# Altium schematic sheet CW308T_CC2538_UFO.SchDoc: UFO Connections
size Letter; Organization: NewAE Technology Inc.; Address1: 1083 Queen St., Suite 196; Address2: Halifax; Address3: NS; Address4: Canada B3H 0B2; SheetApproved: NO
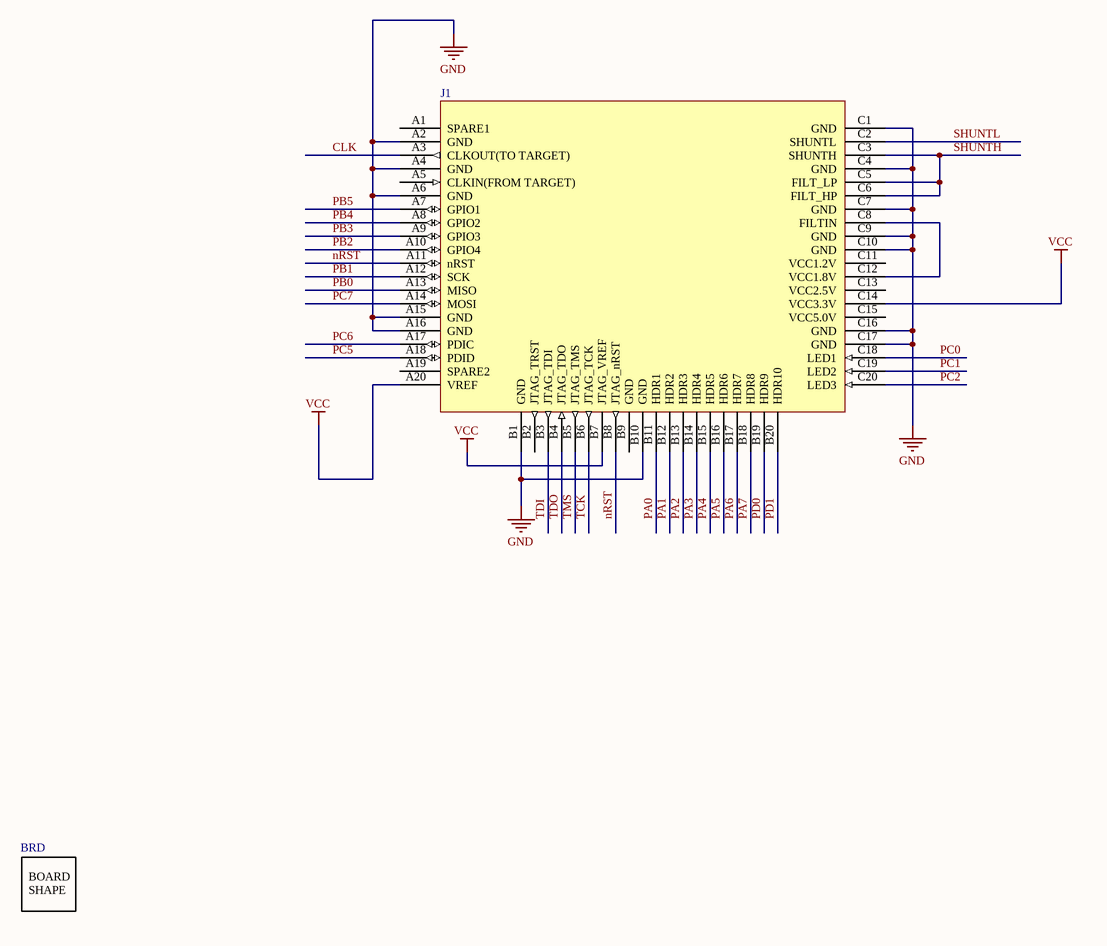
[diagram p0: CW308T_CC2538_UFO.SchDoc]

## Parts
BRD  (no value)  [CW308T_TBOARD_DEFSIZE]
J1  (no value)  [CW308_TBOARD_CONN]

## Nets
GND: J1.A2(GND) J1.A4(GND) J1.A6(GND) J1.A15(GND) J1.A16(GND) J1.B1(GND) J1.B10(GND) J1.C1(GND) J1.C4(GND) J1.C7(GND) J1.C9(GND) J1.C10(GND) J1.C16(GND) J1.C17(GND)
VCC: J1.A20(VREF) J1.B7(JTAG_VREF) J1.C14(VCC3.3V)
CLK: J1.A3(CLKOUT(TO_TARGET))
nRST: J1.A11(nRST) J1.B8(JTAG_nRST)
PA0: J1.B11(HDR1)
PA1: J1.B12(HDR2)
PA2: J1.B13(HDR3)
PA3: J1.B14(HDR4)
PA4: J1.B15(HDR5)
PA5: J1.B16(HDR6)
PA6: J1.B17(HDR7)
PA7: J1.B18(HDR8)
PB0: J1.A13(MISO)
PB1: J1.A12(SCK)
PB2: J1.A10(GPIO4)
PB3: J1.A9(GPIO3)
PB4: J1.A8(GPIO2)
PB5: J1.A7(GPIO1)
PC0: J1.C18(LED1)
PC1: J1.C19(LED2)
PC2: J1.C20(LED3)
PC5: J1.A18(PDID)
PC6: J1.A17(PDIC)
PC7: J1.A14(MOSI)
PD0: J1.B19(HDR9)
PD1: J1.B20(HDR10)
SHUNTH: J1.C3(SHUNTH) J1.C5(FILT_LP) J1.C6(FILT_HP)
SHUNTL: J1.C2(SHUNTL)
TCK: J1.B6(JTAG_TCK)
TDI: J1.B3(JTAG_TDI)
TDO: J1.B4(JTAG_TDO)
TMS: J1.B5(JTAG_TMS)
NetJ1_C8: J1.C8(FILTIN) J1.C12(VCC1.8V)

Not connected (* = marked no-connect by the designer): J1 A1(SPARE1) A5(CLKIN(FROM_TARGET)) A19(SPARE2) B2(JTAG_TRST) B9(GND) C11(VCC1.2V) C13(VCC2.5V) C15(VCC5.0V)

## Notes on the sheet
- Title:
- Date:
- Rev:
- Time:
- Project:
- Sheet
- of
- License:
- Copyright © NewAE Technology Inc.
- Approved:
- NewAE.com
- File:
- (in symbol CW308T_BRDSHAPE_DEFAULT) BOARD / SHAPE

## Library data of the parts
BRD = CW308T_BRDSHAPE_DEFAULT: 308T Board Outline (Layer 1); Component Group: Mechanical; Part Number: CW308T_BRDSHAPE_DEFAULT; Component Kind: Mechanical; Component Type: Mechanical
J1 = CW308_TBOARD: CW308 "Standard" Target Board Connector; Component Group: Mechanical; Pitch: 2.54mm; Part Number: CW308_TBOARD; Pin Count: 60; Mounting Technology: Through-hole; Component Kind: Standard; Component Type: Standard